# Altium schematic sheet 780-00012-P4, Sch M2 Focus Drive_old.SchDoc
size B; PageSetup: Record=PageOptions|CenterHorizontal=True|CenterVertical=True|PrintScale=1.09|XCorrection=1.00|YCorrection=1.00|PrintKind=0|BorderSize=5000000|LeftOffset=0|BottomOffset=0|Orientation=2|PaperLength=1000|PaperWidth=1000|Scale=100|PaperSource=7|PrintQuality=-4|MediaType=1|DitherType=10|PaperKind=Tabloid 11 x 17in|PrintScaleMode=1
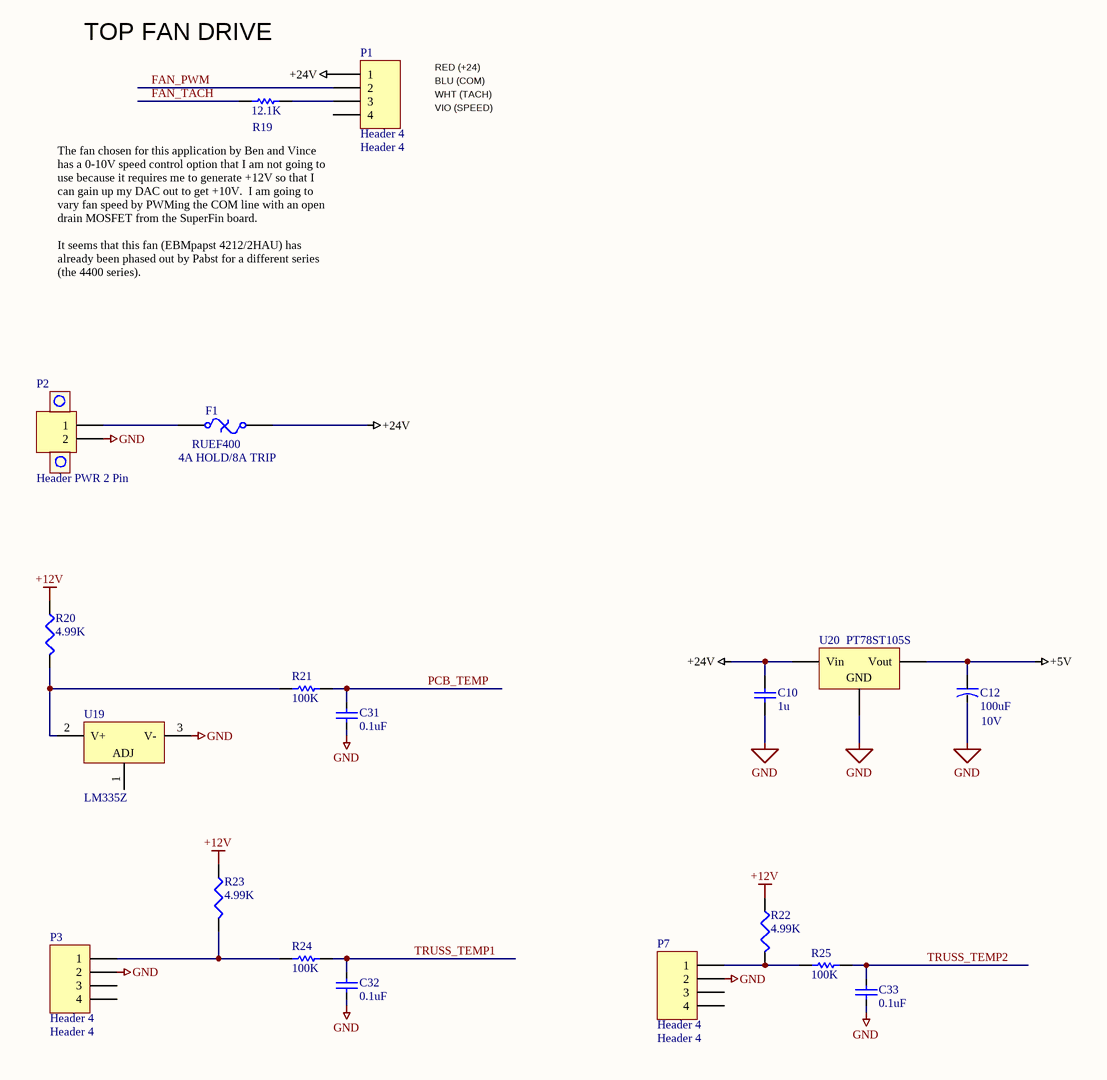
[diagram p0: 780-00012-P4, Sch M2 Focus Drive_old.SchDoc]

## Parts
C10  1u  [2012[0805]]
C12  10V  value 100uF  [SMD_CAP_7343]
C31  value 0.1uF  [SMD_0805]  (hidden comment: Cap SMD)
C32  value 0.1uF  [SMD_0805]  (hidden comment: Cap SMD)
C33  value 0.1uF  [SMD_0805]  (hidden comment: Cap SMD)
F1  RUEF400  value 4A HOLD/8A TRIP  [PolySwitch Radial 0.2]
P1  Header 4  [HDR1X4 for IDC]
P2  Header PWR 2 Pin  [HDR-2 pin w/screw]
P3  Header 4  [HDR1X4 for IDC]
P7  Header 4  [HDR1X4 for IDC]
R19  value 12.1K  [SMD_0805]  (hidden comment: Res 0805)
R20  value 4.99K  [smd_0805]  (hidden comment: Res3)
R21  value 100K  [SMD_0805]  (hidden comment: Res SMD)
R22  value 4.99K  [smd_0805]  (hidden comment: Res3)
R23  value 4.99K  [smd_0805]  (hidden comment: Res3)
R24  value 100K  [SMD_0805]  (hidden comment: Res SMD)
R25  value 100K  [SMD_0805]  (hidden comment: Res SMD)
U19  LM335Z  [Z03A]
U20  PT78ST105S  [PSIP_3_SMD]

## Nets
+5V: C12.pos U20.3(Vout)
+12V: R20.1 R22.1 R23.1
+24V: C10.1 F1.2 P1.1 U20.1(Vin)
GND: C10.2 C12.neg C31.1 C32.1 C33.1 P2.2 P3.2 P7.2 U19.3(V-) U20.2(GND)
SUPPORT: U20.0(SUPPORT)
FAN_PWM: P1.2
FAN_TACH: R19.1
PCB_TEMP: C31.2 R21.1
TRUSS_TEMP1: C32.2 R24.1
TRUSS_TEMP2: C33.2 R25.1
NetF1_1: F1.1 P2.1
NetP1_3: P1.3 R19.2
NetP3_1: P3.1 R23.2 R24.2
NetP7_1: P7.1 R22.2 R25.2
NetR20_2: R20.2 R21.2 U19.2(V+)

Not connected (* = marked no-connect by the designer): P1 4; P3 3 4; P7 3 4; U19 1(ADJ)

## Notes on the sheet
- TOP FAN DRIVE
- RED (+24)
- BLU (COM)
- WHT (TACH)
- VIO (SPEED)
- The fan chosen for this application by Ben and Vince has a 0-10V speed control option that I am not going to use because it requires me to generate +12V so that I can gain up my DAC out to get +10V.  I am going to vary fan speed by PWMing the COM line with an open drain MOSFET from the SuperFin board.
  It seems that this fan (EBMpapst 4212/2HAU) has already been phased out by Pabst for a different series (the 4400 series).

## Library data of the parts
C10 = Cap: Capacitor; Manufacturer: Taiyo Yuden; Manuf p/n: UMK212F105ZG-T; Vendor: DIGIKEY; Vendor Mult.: 10; Vendor p/n: 587-1308-1-ND; LCO p/n: 120-00027; Value: 1u; COST: 0.088
C12 = Cap Tant 35V: outline 6.0mm x 3.2mm; Manufacturer: kEMET; Manuf p/n: T520V107M010ATE045; Vendor: DigiKey; Vendor p/n: 399-4070-1-ND; Vendor Mult.: 1; COST: 3.49
C31-C33 = Cap SMD: Capacitor; Manufacturer: AVX; Manuf p/n: 08055C104KAT2A; Vendor: DigiKey; Vendor p/n: 478-1395-1-ND; Vendor Mult.: 10; LCO p/n: 120-00002; COST: 0.09; Arena Type: Capacitor
F1 = Fuse Thermal: PolySwitch RUE Series; Manufacturer: Tyco Electronics; Vendor: DIGIKEY; Vendor Mult.: 1; Vendor p/n: RUEF400-ND; LCO p/n: 145-00002; COST: 0.50; Manuf p/n: RUEF400
P1 P3 P7 = Header 4: Header, 4-Pin; VALUE: Header 4
P2 = Header 2 PWR: Header, 2-Pin; VALUE: Header 2-pin PWR
R19 = Res SMD: Resistor 0805; Manufacturer: Vishay/Dale; Manuf p/n: CRCW080512.1KFKEA; Vendor: DIGIKEY; Vendor p/n: 541-12.1KCCT-ND; Vendor Mult.: 10; COST: 0.09
R20 R22 R23 = Res3: Resistor; Manufacturer: DALE; Manuf p/n: CRCW08054.99KFKEA; Vendor: DigiKey; Vendor Mult.: 10; Vendor p/n: 541-4.99KCCT-ND; LCO p/n: 181-02001; COST: 0.09; Arena Type: Resistor
R21 R24 R25 = Res SMD: Resistor; Manufacturer: Vishay/Dale; Manuf p/n: CRCW0805100KFKEA; Vendor: DigiKey; Vendor p/n: 541-100KCCT-ND; Vendor Mult.: 10; LCO p/n: 181-01003; COST: 0.09; Arena Type: Resistor
U19 = LM335Z: Precision Temperature Sensor; Manufacturer: National Semiconductor; CompType: Temp Sensor IC; PackageTopMarking: NSXYTT*LM335*Z; PowerWise: N; Published: 29-May-2009; DatasheetVersion: Dec-2008; PackageVersion: revG, Sep-2000; PackageReference: Z03A; Publisher: Altium Limited; PackageDescription: TO-92, Molded, 3 Lead; PartNumber: LM335Z; RoHS: O; PinCount: 3; DigiKeyPartNumber: LM335ZNS-ND; Code_JEDEC: TO-226-AA; ComponentLink1Description: LM335 Datasheet; ComponentLink1URL: http://www.national.com/ds/LM/LM335.pdf; ComponentLink2Description: LM335 Web Page; ComponentLink2URL: http://www.national.com/pf/LM/LM335.html; ComponentLink3Description: Z03A Package Page; ComponentLink3URL: http://www.national.com/packaging/folders/z03a.html
U20 = Volt Reg: Voltage Regulator; Manufacturer: Texas Instruments; Vendor: DIGIKEY; Vendor Mult.: 1; Vendor p/n: PT78ST105S-ND; LCO p/n: 150-00013; COST: 14.41; Manuf p/n: PT78ST105S; Value: PT78ST105S